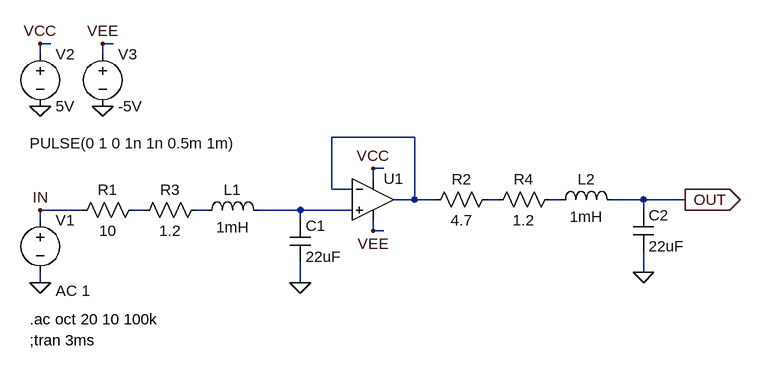
[diagram p0: schematic 4thButterWorthLPF_1mH_r.asc]
4thButterWorthLPF_1mH_r.asc, the LTspice schematic file:
Version 4
SHEET 1 1092 680
WIRE -32 -128 -48 -128
WIRE 64 -128 48 -128
WIRE -48 -112 -48 -128
WIRE 48 -112 48 -128
WIRE 528 16 400 16
WIRE 480 64 464 64
WIRE 464 80 464 64
WIRE 400 96 400 16
WIRE 432 96 400 96
WIRE 528 112 528 16
WIRE 528 112 496 112
WIRE 560 112 528 112
WIRE 656 112 640 112
WIRE 752 112 736 112
WIRE 880 112 832 112
WIRE 944 112 880 112
WIRE 16 128 -48 128
WIRE 112 128 96 128
WIRE 208 128 192 128
WIRE 352 128 288 128
WIRE 432 128 352 128
WIRE 880 128 880 112
WIRE -48 144 -48 128
WIRE 352 144 352 128
WIRE 464 160 464 144
WIRE 480 160 464 160
WIRE 880 224 880 192
WIRE -48 240 -48 224
WIRE 352 240 352 208
FLAG 352 240 0
FLAG -48 240 0
FLAG 944 112 OUT
IOPIN 944 112 Out
FLAG 880 224 0
FLAG 464 64 VCC
FLAG 464 160 VEE
FLAG -48 -32 0
FLAG 48 -32 0
FLAG -48 -128 VCC
FLAG 48 -128 VEE
FLAG -48 128 IN
SYMBOL ind 192 144 R270
WINDOW 0 32 56 VTop 2
WINDOW 3 5 56 VBottom 2
SYMATTR InstName L1
SYMATTR Value 1mH
SYMBOL res 112 112 R90
WINDOW 0 0 56 VBottom 2
WINDOW 3 32 56 VTop 2
SYMATTR InstName R1
SYMATTR Value 10
SYMBOL cap 336 144 R0
SYMATTR InstName C1
SYMATTR Value 22uF
SYMBOL voltage -48 128 R0
WINDOW 123 24 124 Left 2
WINDOW 39 0 0 Left 2
WINDOW 3 -16 -103 Left 2
SYMATTR Value2 AC 1
SYMATTR Value PULSE(0 1 0 1n 1n 0.5m 1m)
SYMATTR InstName V1
SYMBOL ind 736 128 R270
WINDOW 0 32 56 VTop 2
WINDOW 3 5 56 VBottom 2
SYMATTR InstName L2
SYMATTR Value 1mH
SYMBOL res 656 96 R90
WINDOW 0 0 56 VBottom 2
WINDOW 3 32 56 VTop 2
SYMATTR InstName R2
SYMATTR Value 4.7
SYMBOL cap 864 128 R0
SYMATTR InstName C2
SYMATTR Value 22uF
SYMBOL Opamps\\UniversalOpamp2 464 112 R0
SYMATTR InstName U1
SYMBOL voltage -48 -128 R0
WINDOW 123 0 0 Left 2
WINDOW 39 0 0 Left 2
SYMATTR InstName V2
SYMATTR Value 5V
SYMBOL voltage 48 -128 R0
SYMATTR InstName V3
SYMATTR Value -5V
SYMBOL res 208 112 R90
WINDOW 0 0 56 VBottom 2
WINDOW 3 32 56 VTop 2
SYMATTR InstName R3
SYMATTR Value 1.2
SYMBOL res 752 96 R90
WINDOW 0 0 56 VBottom 2
WINDOW 3 32 56 VTop 2
SYMATTR InstName R4
SYMATTR Value 1.2
TEXT -64 296 Left 2 !.ac oct 20 10 100k
TEXT -64 328 Left 2 !;tran 3ms

The netlist it stands for:
* 4thButterWorthLPF_1mH_r.asc
L1 N005 N006 1mH
R1 N004 IN 10
C1 N006 0 22uF
V1 IN 0 PULSE(0 1 0 1n 1n 0.5m 1m) AC 1
L2 N003 OUT 1mH
R2 N002 N001 4.7
C2 OUT 0 22uF
XU1 N006 N001 VCC VEE N001 level.2 Avol=1Meg GBW=10Meg Slew=10Meg ilimit=25m rail=0 Vos=0 phimargin=45 en=0 enk=0 in=0 ink=0 Rin=500Meg  ; pins IN+ IN- V+ V- OUT
V2 VCC 0 5V
V3 VEE 0 -5V
R3 N005 N004 1.2
R4 N003 N002 1.2
.ac oct 20 10 100k
;tran 3ms
.lib UniversalOpamps2.sub
.backanno
.end